# EAGLE schematic inverter-controller (EAGLE 9.6.2)
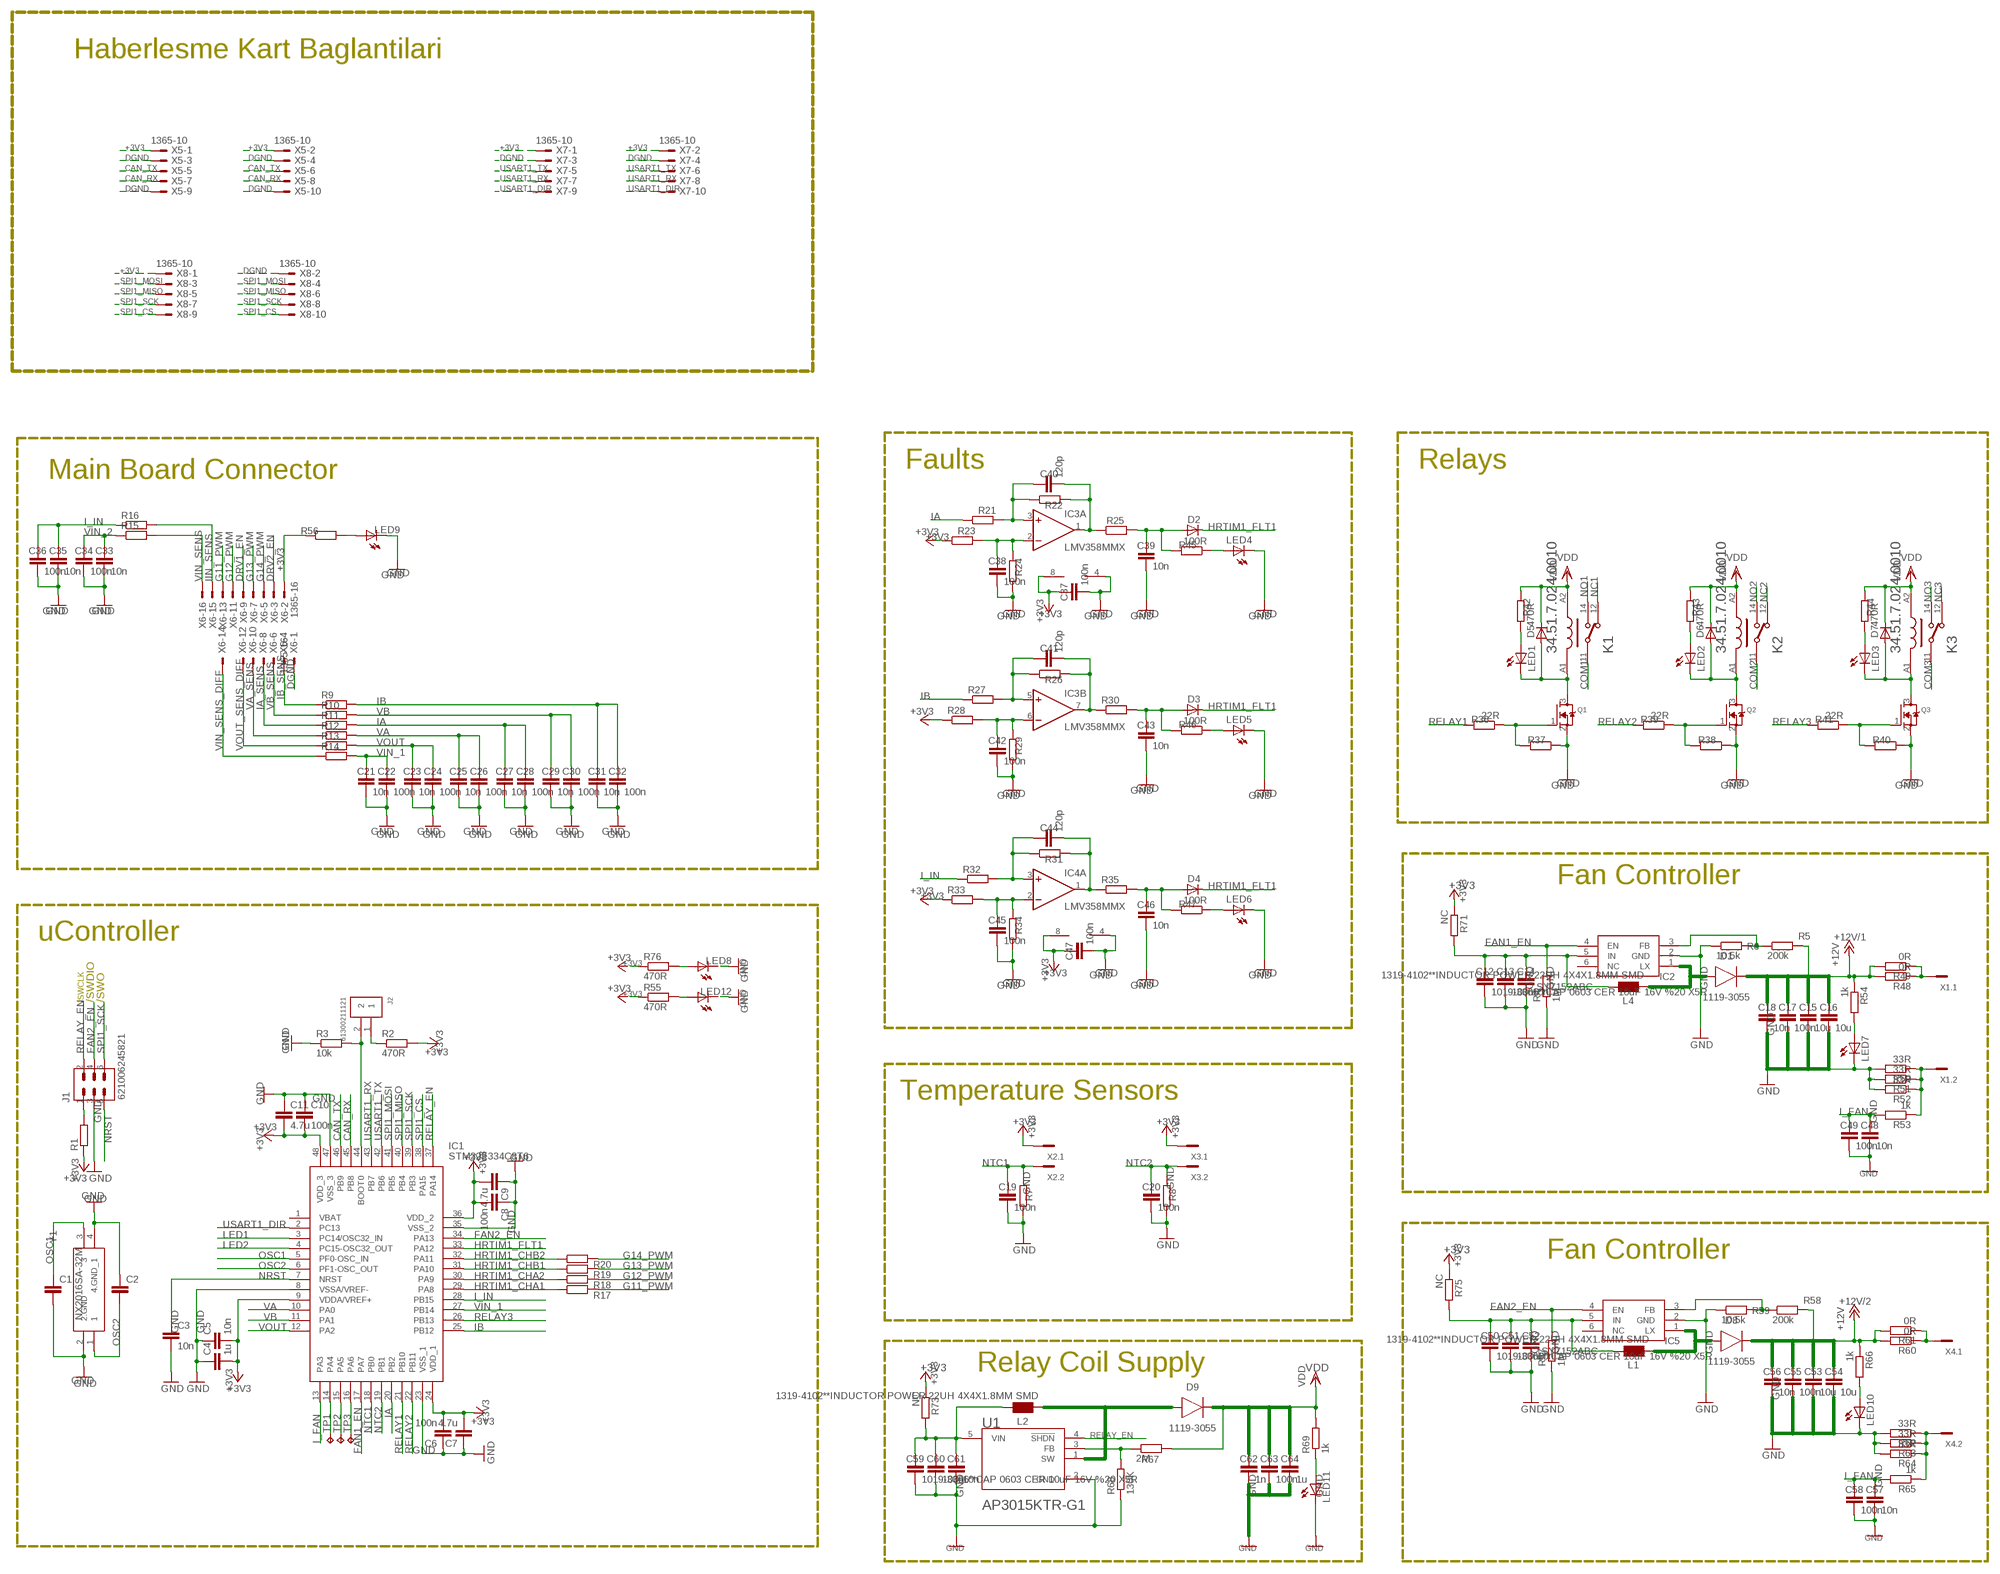
[diagram p0: schematic, sheet 1]

## Parts
C1  C-EUC0603  [C0603]
C2  C-EUC0603  [C0603]
C3  10n  C-EUC0603  [C0603]
C4  1u  C-EUC0603  [C0603]
C5  10n  C-EUC0603  [C0603]
C6  100n  C-EUC0603  [C0603]
C7  4.7u  C-EUC0603  [C0603]
C8  100n  C-EUC0603  [C0603]
C9  4.7u  C-EUC0603  [C0603]
C10  100n  C-EUC0603  [C0603]
C11  4.7u  C-EUC0603  [C0603]
C12  1019-3366**CAP 0603 CER 10uF 16V %20 X5R  C-EUC0603  [C0603]
C13  100n  C-EUC0603  [C0603]
C14  10n  C-EUC0603  [C0603]
C15  10u  C-EUC0805  [C0805]
C16  10u  C-EUC0805  [C0805]
C17  100n  C-EUC0603  [C0603]
C18  10n  C-EUC0603  [C0603]
C19  100n  C-EUC0603  [C0603]
C20  100n  C-EUC0603  [C0603]
C21  10n  C-EUC0603  [C0603]
C22  100n  C-EUC0603  [C0603]
C23  10n  C-EUC0603  [C0603]
C24  100n  C-EUC0603  [C0603]
C25  10n  C-EUC0603  [C0603]
C26  100n  C-EUC0603  [C0603]
C27  10n  C-EUC0603  [C0603]
C28  100n  C-EUC0603  [C0603]
C29  10n  C-EUC0603  [C0603]
C30  100n  C-EUC0603  [C0603]
C31  10n  C-EUC0603  [C0603]
C32  100n  C-EUC0603  [C0603]
C33  10n  C-EUC0603  [C0603]
C34  100n  C-EUC0603  [C0603]
C35  10n  C-EUC0603  [C0603]
C36  100n  C-EUC0603  [C0603]
C37  100n  C-EUC0603  [C0603]
C38  100n  C-EUC0603  [C0603]
C39  10n  C-EUC0603  [C0603]
C40  120p  C-EUC0603  [C0603]
C41  120p  C-EUC0603  [C0603]
C42  100n  C-EUC0603  [C0603]
C43  10n  C-EUC0603  [C0603]
C44  120p  C-EUC0603  [C0603]
C45  100n  C-EUC0603  [C0603]
C46  10n  C-EUC0603  [C0603]
C47  100n  C-EUC0603  [C0603]
C48  10n  C-EUC0603  [C0603]
C49  100n  C-EUC0603  [C0603]
C50  1019-3366**CAP 0603 CER 10uF 16V %20 X5R  C-EUC0603  [C0603]
C51  100n  C-EUC0603  [C0603]
C52  10n  C-EUC0603  [C0603]
C53  10u  C-EUC0805  [C0805]
C54  10u  C-EUC0805  [C0805]
C55  100n  C-EUC0603  [C0603]
C56  10n  C-EUC0603  [C0603]
C57  10n  C-EUC0603  [C0603]
C58  100n  C-EUC0603  [C0603]
C59  1019-3366**CAP 0603 CER 10uF 16V %20 X5R  C-EUC0603  [C0603]
C60  100n  C-EUC0603  [C0603]
C61  10n  C-EUC0603  [C0603]
C62  1n  C-EUC0603  [C0603]
C63  100n  C-EUC0603  [C0603]
C64  1u  C-EUC1206  [C1206]
D1  1119-3055  DIODEDO-214AC(SMA)  [DIOM5226X290N]
D2  DIODE-SOD80C  [SOD80C]
D3  DIODE-SOD80C  [SOD80C]
D4  DIODE-SOD80C  [SOD80C]
D5  DIODE-SOD80C  [SOD80C]
D6  DIODE-SOD80C  [SOD80C]
D7  DIODE-SOD80C  [SOD80C]
D8  1119-3055  DIODEDO-214AC(SMA)  [DIOM5226X290N]
D9  1119-3055  DIODEDO-214AC(SMA)  [DIOM5226X290N]
IC1  STM32F334C8T6  [QFP50P900X900X160-48N]
IC2  SY7152ABC  [SOT95P285X140-6N]
IC3  LMV358MMX  [MSOP08]
IC4  LMV358MMX  [MSOP08]
IC5  SY7152ABC  [SOT95P285X140-6N]
J1  621006245821  [621006245821]
J2  61300211121  [61300211121]
K1  FINDER_34.51.7.024.0010FINDER_34.51.7.024.0010_0_0  [FINDER_34.51.7.024.0010_0]
K2  FINDER_34.51.7.024.0010FINDER_34.51.7.024.0010_0_0  [FINDER_34.51.7.024.0010_0]
K3  FINDER_34.51.7.024.0010FINDER_34.51.7.024.0010_0_0  [FINDER_34.51.7.024.0010_0]
L1  1319-4102**INDUCTOR POWER 22UH 4X4X1.8MM SMD  WE-PD2_S  [WE-PD2_S]
L2  1319-4102**INDUCTOR POWER 22UH 4X4X1.8MM SMD  WE-PD2_S  [WE-PD2_S]
L4  1319-4102**INDUCTOR POWER 22UH 4X4X1.8MM SMD  WE-PD2_S  [WE-PD2_S]
LED1  LEDCHIPLED_0805  [CHIPLED_0805]
LED2  LEDCHIPLED_0805  [CHIPLED_0805]
LED3  LEDCHIPLED_0805  [CHIPLED_0805]
LED4  LEDCHIPLED_0805  [CHIPLED_0805]
LED5  LEDCHIPLED_0805  [CHIPLED_0805]
LED6  LEDCHIPLED_0805  [CHIPLED_0805]
LED7  LEDCHIPLED_0805  [CHIPLED_0805]
LED8  LEDCHIPLED_0805  [CHIPLED_0805]
LED9  LEDCHIPLED_0805  [CHIPLED_0805]
LED10  LEDCHIPLED_0805  [CHIPLED_0805]
LED11  LEDCHIPLED_0805  [CHIPLED_0805]
LED12  LEDCHIPLED_0805  [CHIPLED_0805]
Q1  MOSFET-NREFLOW  [SOT23]
Q2  MOSFET-NREFLOW  [SOT23]
Q3  MOSFET-NREFLOW  [SOT23]
R1  R-EU_R0603  [R0603]
R2  470R  R-EU_R0603  [R0603]
R3  10k  R-EU_R0603  [R0603]
R4  1M  R-EU_R0603  [R0603]
R5  200k  R-EU_R0603  [R0603]
R6  10.5k  R-EU_R0603  [R0603]
R7  R-EU_R0603  [R0603]
R8  R-EU_R0603  [R0603]
R9  R-EU_R0603  [R0603]
R10  R-EU_R0603  [R0603]
R11  R-EU_R0603  [R0603]
R12  R-EU_R0603  [R0603]
R13  R-EU_R0603  [R0603]
R14  R-EU_R0603  [R0603]
R15  R-EU_R0603  [R0603]
R16  R-EU_R0603  [R0603]
R17  R-EU_R0603  [R0603]
R18  R-EU_R0603  [R0603]
R19  R-EU_R0603  [R0603]
R20  R-EU_R0603  [R0603]
R21  R-EU_R0603  [R0603]
R22  R-EU_R0603  [R0603]
R23  R-EU_R0603  [R0603]
R24  R-EU_R0603  [R0603]
R25  R-EU_R0603  [R0603]
R26  R-EU_R0603  [R0603]
R27  R-EU_R0603  [R0603]
R28  R-EU_R0603  [R0603]
R29  R-EU_R0603  [R0603]
R30  R-EU_R0603  [R0603]
R31  R-EU_R0603  [R0603]
R32  R-EU_R0603  [R0603]
R33  R-EU_R0603  [R0603]
R34  R-EU_R0603  [R0603]
R35  R-EU_R0603  [R0603]
R36  22R  R-EU_R0603  [R0603]
R37  R-EU_R0603  [R0603]
R38  R-EU_R0603  [R0603]
R39  22R  R-EU_R0603  [R0603]
R40  R-EU_R0603  [R0603]
R41  22R  R-EU_R0603  [R0603]
R42  470R  R-EU_R0603  [R0603]
R43  470R  R-EU_R0603  [R0603]
R44  470R  R-EU_R0603  [R0603]
R45  100R  R-EU_R0603  [R0603]
R46  100R  R-EU_R0603  [R0603]
R47  100R  R-EU_R0603  [R0603]
R48  0R  R-EU_R0603  [R0603]
R49  0R  R-EU_R0603  [R0603]
R50  33R  R-EU_R0603  [R0603]
R51  33R  R-EU_R0603  [R0603]
R52  33R  R-EU_R0603  [R0603]
R53  1k  R-EU_R0603  [R0603]
R54  1k  R-EU_R0603  [R0603]
R55  470R  R-EU_R0603  [R0603]
R56  R-EU_R0603  [R0603]
R57  1M  R-EU_R0603  [R0603]
R58  200k  R-EU_R0603  [R0603]
R59  10.5k  R-EU_R0603  [R0603]
R60  0R  R-EU_R0603  [R0603]
R61  0R  R-EU_R0603  [R0603]
R62  33R  R-EU_R0603  [R0603]
R63  33R  R-EU_R0603  [R0603]
R64  33R  R-EU_R0603  [R0603]
R65  1k  R-EU_R0603  [R0603]
R66  1k  R-EU_R0603  [R0603]
R67  2M  R-EU_R0603  [R0603]
R68  130K  R-EU_R0603  [R0603]
R69  1k  R-EU_R0603  [R0603]
R71  NC  R-EU_R0603  [R0603]
R73  NC  R-EU_R0603  [R0603]
R75  NC  R-EU_R0603  [R0603]
R76  470R  R-EU_R0603  [R0603]
TP1  TPB1,27  [B1,27]
TP2  TPB1,27  [B1,27]
TP3  TPB1,27  [B1,27]
U1  DIODES_AP3015KTR-G1DIODES_AP3015KTR-G1_0_0  [DIODES_AP3015KTR-G1_0]
X1  0289-9066**15EDGVC-3.81-02P-14  MCV2  [MCV2]
X2  0289-9066**15EDGVC-3.81-02P-14  MCV2  [MCV2]
X3  0289-9066**15EDGVC-3.81-02P-14  MCV2  [MCV2]
X4  0289-9066**15EDGVC-3.81-02P-14  MCV2  [MCV2]
X5  1365-10  [1365-10]
X6  1365-16  [1365-16]
X7  1365-10  [1365-10]
X8  1365-10  [1365-10]
Y1  NX2016SA-32M  [NX2016SA-32M]

## Nets
+3V3: C4.2 C5.2 C6.2 C7.2 C8.2 C9.2 C10.2 C11.2 C37.1 C47.1 IC1.9(VDDA/VREF+) IC1.24(VDD_1) IC1.36(VDD_2) IC1.48(VDD_3) IC3.8(P:V+) IC4.8(P:V+) R1.1 R2.2 R23.1 R28.1 R33.1 R55.1 R56.1 R71.1 R73.1 R75.1 R76.1 X2.1 X3.1 X5.1 X5.2 X6.2 X7.1 X7.2 X8.1
+12V/1: C15.1 C16.1 C17.1 C18.1 D1.1(C) R5.2 R48.2 R49.2 R54.1 ; supply symbol labelled +12V
+12V/2: C53.1 C54.1 C55.1 C56.1 D8.1(C) R58.2 R60.2 R61.2 R66.1 ; supply symbol labelled +12V
CAN_RX: IC1.45(PB8) X5.7 X5.8
CAN_TX: IC1.46(PB9) X5.5 X5.6
COM1: K1.11
COM2: K2.11
COM3: K3.11
DGND: X5.3 X5.4 X5.9 X5.10 X6.1 X7.3 X7.4 X8.2
DRV1_EN: X6.9
DRV2_EN: X6.3
FAN1_EN: IC1.17(PA7) IC2.4(EN) R4.2
FAN2_EN: IC1.34(PA13) IC5.4(EN) J1.4 R57.2
G11_PWM: R17.2 X6.13
G12_PWM: R18.2 X6.11
G13_PWM: R19.2 X6.7
G14_PWM: R20.2 X6.5
GND: C1.2 C2.1 C3.2 C4.1 C5.1 C6.1 C7.1 C8.1 C9.1 C10.1 C11.1 C12.2 C13.2 C14.2 C15.2 C16.2 C17.2 C18.2 C19.2 C20.2 C21.2 C22.2 C23.2 C24.2 C25.2 C26.2 C27.2 C28.2 C29.2 C30.2 C31.2 C32.2 C33.2 C34.2 C35.2 C36.2 C37.2 C38.2 C39.2 C42.2 C43.2 C45.2 C46.2 C47.2 C48.2 C49.2 C50.2 C51.2 C52.2 C53.2 C54.2 C55.2 C56.2 C57.2 C58.2 C59.2 C60.2 C61.2 C62.2 C63.2 C64.2 IC1.8(VSSA/VREF-) IC1.23(VSS_1) IC1.35(VSS_2) IC1.47(VSS_3) IC2.2(GND) IC3.4(P:V-) IC4.4(P:V-) IC5.2(GND) J1.3 LED4.C LED5.C LED6.C LED7.C LED8.C LED9.C LED10.C LED11.C LED12.C Q1.2(S) Q2.2(S) Q3.2(S) R3.1 R4.1 R6.1 R7.1 R8.1 R24.1 R29.1 R34.1 R37.1 R38.1 R40.1 R50.2 R51.2 R52.2 R57.1 R59.1 R62.2 R63.2 R64.2 R68.1 U1.2(GND) Y1.2(2.GND) Y1.4(4.GND_1)
HRTIM1_CHA1: IC1.29(PA8) R17.1
HRTIM1_CHA2: IC1.30(PA9) R18.1
HRTIM1_CHB1: IC1.31(PA10) R19.1
HRTIM1_CHB2: IC1.32(PA11) R20.1
HRTIM1_FLT1: D2.C D3.C D4.C IC1.33(PA12)
I_FAN: C48.1 C49.1 C57.1 C58.1 IC1.13(PA3) R53.2 R65.2
I_IN: C35.1 C36.1 IC1.28(PB15) R16.1 R32.1
IA: C27.1 C28.1 IC1.20(PB2) R11.2 R21.1
IA_SENS: R11.1 X6.8
IB: C31.1 C32.1 IC1.25(PB12) R9.2 R27.1
IB_SENS: R9.1 X6.4
IIN_SENS: R16.2 X6.15
LED1: IC1.3(PC14/OSC32_IN)
LED2: IC1.4(PC15-OSC32_OUT)
N$1: C40.2 IC3.1(A:OUT) R22.2 R25.1
N$2: J2.1 R2.1
N$3: IC1.14(PA4) TP1.TP
N$4: IC1.15(PA5) TP2.TP
N$5: IC1.16(PA6) TP3.TP
N$6: IC1.44(BOOT0) J2.2 R3.2
N$7: C40.1 IC3.3(A:+IN) R21.2 R22.1
N$8: IC2.3(FB) R5.1 R6.2
N$9: LED7.A R54.2
N$10: R50.1 R51.1 R52.1 R53.1 X1.2
N$11: J1.1 R1.2
N$12: D1.2(A) IC2.1(LX) L4.2
N$13: C39.1 D2.A R25.2 R45.2
N$14: C43.1 D3.A R30.2 R46.2
N$15: C38.1 IC3.2(A:-IN) R23.2 R24.2
N$16: C41.1 IC3.5(B:+IN) R26.1 R27.2
N$17: C44.1 IC4.3(A:+IN) R31.1 R32.2
N$18: C42.1 IC3.6(B:-IN) R28.2 R29.2
N$19: C41.2 IC3.7(B:OUT) R26.2 R30.1
N$20: C46.1 D4.A R35.2 R47.2
N$21: C45.1 IC4.2(A:-IN) R33.2 R34.2
N$22: LED2.A R43.1
N$23: C44.2 IC4.1(A:OUT) R31.2 R35.1
N$24: Q1.1(G) R36.1 R37.2
N$25: Q2.1(G) R38.2 R39.1
N$26: LED5.A R46.1
N$27: LED1.A R42.1
N$28: Q3.1(G) R40.2 R41.1
N$29: D5.A K1.A1 LED1.C Q1.3(D)
N$30: D6.A K2.A1 LED2.C Q2.3(D)
N$31: D7.A K3.A1 LED3.C Q3.3(D)
N$32: LED6.A R47.1
N$33: LED3.A R44.1
N$34: R48.1 R49.1 X1.1
N$35: LED8.A R76.2
N$36: D8.2(A) IC5.1(LX) L1.2
N$37: LED4.A R45.1
N$39: LED9.A R56.2
N$40: IC5.3(FB) R58.1 R59.2
N$41: R60.1 R61.1 X4.1
N$42: R62.1 R63.1 R64.1 R65.1 X4.2
N$43: LED10.A R66.2
N$44: D9.2(A) L2.2 U1.1(SW)
N$45: R67.1 R68.2 U1.3(FB)
N$47: LED12.A R55.2
N$48: C12.1 C13.1 C14.1 IC2.5(IN) L4.1 R71.2
N$49: LED11.A R69.1
N$50: C59.1 C60.1 C61.1 L2.1 R73.2 U1.5(VIN)
N$51: C50.1 C51.1 C52.1 IC5.5(IN) L1.1 R75.2
NC1: K1.12
NC2: K2.12
NC3: K3.12
NO1: K1.14
NO2: K2.14
NO3: K3.14
NRST: C3.1 IC1.7(NRST) J1.5
NTC1: C19.1 IC1.18(PB0) R7.2 X2.2
NTC2: C20.1 IC1.19(PB1) R8.2 X3.2
OSC1: C1.1 IC1.5(PF0-OSC_IN) Y1.3
OSC2: C2.2 IC1.6(PF1-OSC_OUT) Y1.1
RELAY1: IC1.21(PB10) R36.2
RELAY2: IC1.22(PB11) R39.2
RELAY3: IC1.26(PB13) R41.2
RELAY_EN: IC1.37(PA14) J1.2 U1.4(!SHDN!)
SPI1_CS: IC1.38(PA15) X8.9 X8.10
SPI1_MISO: IC1.40(PB4) X8.5 X8.6
SPI1_MOSI: IC1.41(PB5) X8.3 X8.4
SPI1_SCK: IC1.39(PB3) J1.6 X8.7 X8.8
USART1_DIR: IC1.2(PC13) X7.9 X7.10
USART1_RX: IC1.43(PB7) X7.7 X7.8
USART1_TX: IC1.42(PB6) X7.5 X7.6
VA: C25.1 C26.1 IC1.10(PA0) R12.2
VA_SENS: R12.1 X6.10
VB: C29.1 C30.1 IC1.11(PA1) R10.2
VB_SENS: R10.1 X6.6
VDD: C62.1 C63.1 C64.1 D5.C D6.C D7.C D9.1(C) K1.A2 K2.A2 K3.A2 R42.2 R43.2 R44.2 R67.2 R69.2
VIN_1: C21.1 C22.1 IC1.27(PB14) R14.2
VIN_2: C33.1 C34.1 R15.1
VIN_SENS: R15.2 X6.16
VIN_SENS_DIFF: R14.1 X6.14
VOUT: C23.1 C24.1 IC1.12(PA2) R13.2
VOUT_SENS_DIFF: R13.1 X6.12
Unconnected: IC1.1(VBAT) IC2.6(NC) IC4.5(B:+IN) IC4.6(B:-IN) IC4.7(B:OUT) IC5.6(NC)

## Notes on the sheet
- Haberlesme Kart Baglantilari
- Faults | Relays
- Main Board Connector
- Fan Controller
- uController
- /SWCLK | /SWDIO | /SWO
- Temperature Sensors
- Fan Controller
- Relay Coil Supply

## Library data of the parts
C1-C64 = rcl:C-EU: CAPACITOR, European symbol; SPICEPREFIX: C
D1 D8 D9 = Diode:DIODE: Diode Rectifier - Generic; CATEGORY: Diode; SUB-CATEGORY: Rectifier; VALUE: DIODE
D2-D7 = diode:DIODE-: DIODE
IC1 = STM32F334C8T6:STM32F334C8T6: STMICROELECTRONICS - STM32F334C8T6 - MCU, 32BIT, CORTEX-M4, 72MHZ, LQFP-48 Source: Datasheet <http://www.st.com/content/ccc/resource/technical/document/datasheet/d1/cd/3d/18/a2/2c/4e/d0/DM00097745.pdf/files/DM00097745.pdf/jcr:content/translations/en.DM00097745.pdf>; ARROW_PART_NUMBER: STM32F334C8T6; ARROW_PRICE-STOCK: https://www.arrow.com/en/products/stm32f334c8t6/stmicroelectronics; DESCRIPTION: STMICROELECTRONICS - STM32F334C8T6 - MCU, 32BIT, CORTEX-M4, 72MHZ, LQFP-48; HEIGHT: 1.6mm; MANUFACTURER_NAME: STMicroelectronics; MANUFACTURER_PART_NUMBER: STM32F334C8T6; MOUSER_PART_NUMBER: 511-STM32F334C8T6; MOUSER_PRICE-STOCK: https://www.mouser.co.uk/ProductDetail/STMicroelectronics/STM32F334C8T6/?qs=9MuLHSklicqt3Oowy%252Bwgaw%3D%3D
IC2 IC5 = SY7152ABC:SY7152ABC: High Efficiency 1MHz, 2A Step Up Regulator Source: Datasheet <https://datasheet.lcsc.com/szlcsc/Silergy-Corp-SY7152ABC_C106907.pdf>; DESCRIPTION: High Efficiency 1MHz, 2A Step Up Regulator; HEIGHT: 1.4mm; MANUFACTURER_NAME: Silergy Corp; MANUFACTURER_PART_NUMBER: SY7152ABC
IC3 IC4 = linear:LMV358?*: Dual General Purpose, Low Voltage, Rail-to-Rail Output Operational Amplifiers Source: http://www.national.com/mpf/LM/LMV321.html http://www.national.com/dt/lmv_qual.pdf
J1 = Headers:621006245821: 2.00mm SMT Straight Dual Low Profile Pin Header WR-PHD Manufacturer's datasheet <https://katalog.we-online.com/em/datasheet/621006245821.pdf>; CREATED_BY: PCBLayout.com; MANUFACTURER: Wurth Elektronik; MPN: 621006245821
J2 = Headers:61300211121: CONN HEADER VERT 2POS 2.54MM Manufacturer's datasheet <https://katalog.we-online.de/em/datasheet/6130xx11121.pdf>; CREATED_BY: PCBLayout.com; DIGI_KEY_PART_NUMBER: 732-5315-ND; MANUFACTURER: Wurth Electronics Inc.; MPN: 61300211121
K1-K3 = Finder - 34.51.7.024.0010:FINDER_34.51.7.024.0010: Slim electromechanical PCB relays 6 A; AMBIENT_TEMPERATURE_RANGE_HIGH: +85°C; AMBIENT_TEMPERATURE_RANGE_LOW: -40°C; CENTROID_NOT_SPECIFIED: No; DATASHEET: https://gfinder.findernet.com/public/attachments/34/EN/S34EN.pdf; DEVICE_CLASS_L1: Electromechanical; DEVICE_CLASS_L2: Relays; DEVICE_CLASS_L3: Solid State Relays; HEIGHT: 15mm; LEAD_FREE: yes; MF: Finder; MFG_PACKAGE_IDENT: 34.51; MFG_PACKAGE_IDENT_DATE: 0; MFG_PACKAGE_IDENT_REV: 0; MPN: 34.51.7.024.0010; ON_STATE_RESISTANCE: 3.35kΩ; PACKAGE: PTH_RELAY_28MM0_5MM0; PREFIX: K; ROHS: yes; STANDOFF_HEIGHT: 0.3mm; THROW_CONFIGURATION: SPDT; VERIFICATION_VERSION: 0.0.0.1; VOLTAGE_RATING_AC: 250V; VOLTAGE_RATING_DC: 24V
L1 L2 L4 = wuerth-elektronik:WE-PD2: SMD-Power Inductors WE-PD2 Is recommended for the application with switching regulators from National Semiconductor, Linear Technology, Texas Instruments and Fairchild Semiconductor -- Switching regulators with low operating voltages (computer, laptop, mobile phones, pagers) -- Integrated DC/DC-converter
LED1-LED12 = adafruit:LED: LED OSRAM: - CHIPLED LG R971, LG N971, LY N971, LG Q971, LY Q971, LO R971, LY R971 LH N974, LH R974 LS Q976, LO Q976, LY Q976 LO Q996 - Hyper CHIPLED LW Q18S LB Q993, LB Q99A, LB R99A - SideLED LS A670, LO A670, LY A670, LG A670, LP A670 LB A673, LV A673, LT A673, LW A673 LH A674 LY A675 LS A676, LA A676, LO A676, LY A676, LW A676 LS A679, LY A679, LG A679 - Hyper Micro SIDELED® LS Y876, LA Y876, LO Y876, LY Y876 LT Y87S - SmartLED LW L88C, LW L88S LB L89C, LB L89S, LG L890 LS L89K, LO L89K, LY L89K LS L896, LA L896, LO L896, LY L896 - TOPLED LS T670, LO T670, LY T670, LG T670, LP T670 LSG T670, LSP T670, LSY T670, LOP T670, LYG T670 LG T671, LOG T671, LSG T671 LB T673, LV T673, LT T673, LW T673 LH T674 LS T676, LA T676, LO T676, LY T676, LB T676, LH T676, LSB T676, LW T676 LB T67C, LV T67C, LT T67C, LS T67K, LO T67K, LY T67K, LW E67C LS E67B, LA E67B, LO E67B, LY E67B, LB E67C, LV E67C, LT E67C LW T67C LS T679, LY T679, LG T679 LS T770, LO T770, LY T770, LG T770, LP T770 LB T773, LV T773, LT T773, LW T773 LH T774 LS E675, LA E675, LY E675, LS T675 LS T776, LA T776, LO T776, LY T776, LB T776 LHGB T686 LT T68C, LB T68C - Hyper Mini TOPLED® LB M676 - Mini TOPLED Santana® LG M470 LS M47K, LO M47K, LY M47K Source: http://www.osram.convergy.de/
Q1-Q3 = adafruit:MOSFET-N: N-Channel Mosfet 2N7002E - 60V 260mA SOT23 [Digikey: 2N7002ET1GOSTR-ND] - REEL BSH103 - 30V 850mA SOT23 [Digikey: 568-5013-1-ND]
R1-R69 R71 R73 R75 R76 = rcl:R-EU_: RESISTOR, European symbol; SPICEPREFIX: R
TP1-TP3 = testpad:TP: Test pad
U1 = AP3015KTR-G1:DIODES_AP3015KTR-G1: IC REG BOOST ADJ 0.3A SOT25; AMBIENT_TEMPERATURE_RANGE_HIGH: +85°C; AMBIENT_TEMPERATURE_RANGE_LOW: -40°C; CENTROID_NOT_SPECIFIED: No; DATASHEET: https://www.diodes.com/assets/Datasheets/AP3015_A.pdf; DEVICE_CLASS_L1: Integrated Circuits (ICs); DEVICE_CLASS_L2: Power Management ICs; DEVICE_CLASS_L3: Voltage Regulators - Switching; DIGIKEY_DESCRIPTION: IC REG BOOST ADJ 0.3A SOT25; DIGIKEY_PART_NUMBER: AP3015KTR-G1DICT-ND; FOOTPRINT_URL: https://www.diodes.com/assets/Package-Files/SOT25.pdf; HEIGHT: 1.4mm; LEAD_FREE: yes; MAX_JUNCTION_TEMP: +150°C; MAX_SUPPLY_VOLTAGE: 12V; MF: Diodes; MFG_PACKAGE_IDENT: SOT25; MFG_PACKAGE_IDENT_DATE: 04/2017; MFG_PACKAGE_IDENT_REV: 0; MIN_SUPPLY_VOLTAGE: 1.2V; MOUSER_DESCRIPTION: Voltage Regulators - Switching Regulators 100mA DC/DC 200mV 1.2V to 12V; MOUSER_PART_NUMBER: 621-AP3015KTR-G1; MPN: AP3015KTR-G1; NOMINAL_SUPPLY_CURRENT: 17uA; NUMBER_OF_OUTPUTS: 1; OUTPUT_CURRENT: 350mA; OUTPUT_VOLTAGE: 34V; PACKAGE: SOT-23-5; PREFIX: U; ROHS: yes; STANDOFF_HEIGHT: 0.013mm; SWITCHING_TOPOLOGY: Boost; TEMPERATURE_RANGE_HIGH: +85°C; TEMPERATURE_RANGE_LOW: -40°C; VERIFICATION_VERSION: 0.0.0.1
X1-X4 = con-phoenix-381_l:MCV2: Mini-Combicon 3.81mm vertikal 2polig (ohne Gegenstecker)
X5 X7 X8 = con-leotronics:1365-10: DUAL ROW STRAIGHT HEADER 1364 SERIES. 1.27mm x 1.27mm. Without Fixing Post. SMT Source: http://www.leotronics.co.uk/Conexcon/Data%20Sheets/sec.%20A/1364ing.pdf; OC_FARNELL: unknown; OC_NEWARK: unknown
X6 = con-leotronics:1365-16: DUAL ROW STRAIGHT HEADER 1364 SERIES. 1.27mm x 1.27mm. Without Fixing Post. SMT Source: http://www.leotronics.co.uk/Conexcon/Data%20Sheets/sec.%20A/1364ing.pdf; OC_FARNELL: unknown; OC_NEWARK: unknown
Y1 = enko:NX2016SA-32M